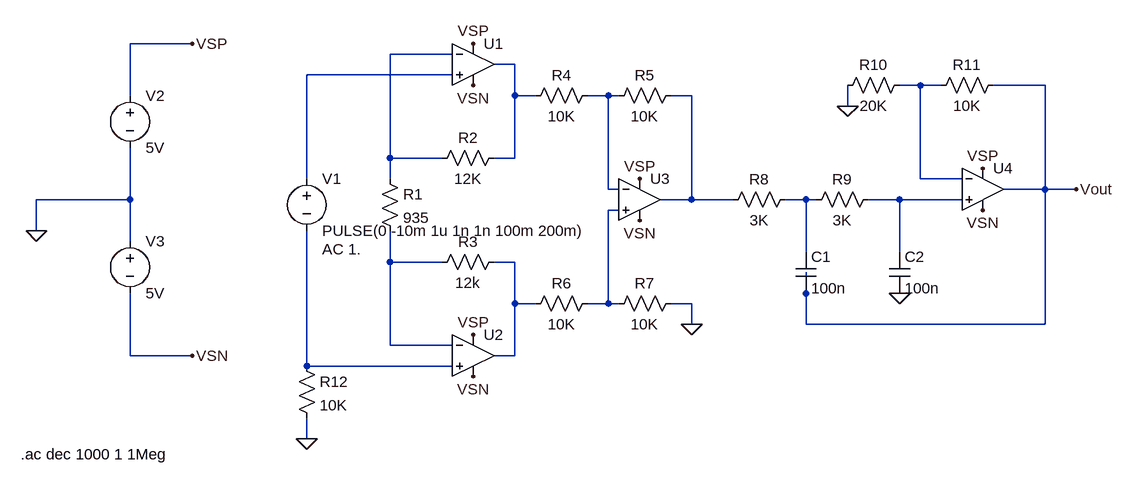
[diagram p0: schematic Draft1.asc]
Draft1.asc, the LTspice schematic file:
Version 4
SHEET 1 1476 760
WIRE 48 112 -48 112
WIRE 448 128 352 128
WIRE 544 144 512 144
WIRE 448 160 224 160
WIRE 1168 176 1136 176
WIRE 1200 176 1168 176
WIRE 1360 176 1280 176
WIRE -48 192 -48 112
WIRE 544 192 544 144
WIRE 576 192 544 192
WIRE 688 192 656 192
WIRE 704 192 688 192
WIRE 816 192 784 192
WIRE 1056 208 1056 176
WIRE 352 288 352 128
WIRE 432 288 352 288
WIRE 544 288 544 192
WIRE 544 288 512 288
WIRE 224 320 224 160
WIRE 352 320 352 288
WIRE 1168 320 1168 176
WIRE 1232 320 1168 320
WIRE 688 336 688 192
WIRE 704 336 688 336
WIRE 1360 336 1360 176
WIRE 1360 336 1296 336
WIRE 1408 336 1360 336
WIRE -48 352 -48 272
WIRE -48 352 -192 352
WIRE 816 352 816 192
WIRE 816 352 768 352
WIRE 880 352 816 352
WIRE 992 352 960 352
WIRE 1008 352 992 352
WIRE 1136 352 1088 352
WIRE 1232 352 1136 352
WIRE 704 368 688 368
WIRE -192 400 -192 352
WIRE -48 416 -48 352
WIRE 992 432 992 352
WIRE 1136 432 1136 352
WIRE 352 448 352 400
WIRE 432 448 352 448
WIRE 544 448 512 448
WIRE 992 496 992 464
WIRE 544 512 544 448
WIRE 576 512 544 512
WIRE 688 512 688 368
WIRE 688 512 656 512
WIRE 704 512 688 512
WIRE 816 512 784 512
WIRE 816 544 816 512
WIRE 992 544 992 496
WIRE 1360 544 1360 336
WIRE 1360 544 992 544
WIRE 352 576 352 448
WIRE 448 576 352 576
WIRE -48 592 -48 496
WIRE 48 592 -48 592
WIRE 544 592 544 512
WIRE 544 592 512 592
WIRE 224 608 224 400
WIRE 448 608 224 608
WIRE 224 720 224 688
FLAG -192 400 0
FLAG 48 112 VSP
FLAG 48 592 VSN
FLAG 480 112 VSP
FLAG 480 560 VSP
FLAG 736 320 VSP
FLAG 1264 304 VSP
FLAG 480 176 VSN
FLAG 480 624 VSN
FLAG 736 384 VSN
FLAG 1264 368 VSN
FLAG 224 720 0
FLAG 816 544 0
FLAG 1056 208 0
FLAG 1408 336 Vout
FLAG 1136 496 0
SYMBOL OpAmps/UniversalOpAmp2 480 144 R0
SYMATTR InstName U1
SYMBOL OpAmps/UniversalOpAmp2 480 592 R0
SYMATTR InstName U2
SYMBOL OpAmps/UniversalOpAmp2 736 352 R0
SYMATTR InstName U3
SYMBOL OpAmps/UniversalOpAmp2 1264 336 R0
SYMATTR InstName U4
SYMBOL voltage -48 176 R0
SYMATTR InstName V2
SYMATTR Value 5V
SYMBOL voltage -48 400 R0
SYMATTR InstName V3
SYMATTR Value 5V
SYMBOL res 336 304 R0
SYMATTR InstName R1
SYMATTR Value 935
SYMBOL res 528 272 R90
WINDOW 0 0 56 VBottom 2
WINDOW 3 32 56 VTop 2
SYMATTR InstName R2
SYMATTR Value 12K
SYMBOL res 528 432 R90
WINDOW 0 0 56 VBottom 2
WINDOW 3 32 56 VTop 2
SYMATTR InstName R3
SYMATTR Value 12k
SYMBOL res 672 176 R90
WINDOW 0 0 56 VBottom 2
WINDOW 3 32 56 VTop 2
SYMATTR InstName R4
SYMATTR Value 10K
SYMBOL res 800 176 R90
WINDOW 0 0 56 VBottom 2
WINDOW 3 32 56 VTop 2
SYMATTR InstName R5
SYMATTR Value 10K
SYMBOL res 672 496 R90
WINDOW 0 0 56 VBottom 2
WINDOW 3 32 56 VTop 2
SYMATTR InstName R6
SYMATTR Value 10K
SYMBOL res 800 496 R90
WINDOW 0 0 56 VBottom 2
WINDOW 3 32 56 VTop 2
SYMATTR InstName R7
SYMATTR Value 10K
SYMBOL res 976 336 R90
WINDOW 0 0 56 VBottom 2
WINDOW 3 32 56 VTop 2
SYMATTR InstName R8
SYMATTR Value 3K
SYMBOL res 1104 336 R90
WINDOW 0 0 56 VBottom 2
WINDOW 3 32 56 VTop 2
SYMATTR InstName R9
SYMATTR Value 3K
SYMBOL res 1152 160 R90
WINDOW 0 0 56 VBottom 2
WINDOW 3 32 56 VTop 2
SYMATTR InstName R10
SYMATTR Value 20K
SYMBOL res 1296 160 R90
WINDOW 0 0 56 VBottom 2
WINDOW 3 32 56 VTop 2
SYMATTR InstName R11
SYMATTR Value 10K
SYMBOL res 208 592 R0
SYMATTR InstName R12
SYMATTR Value 10K
SYMBOL cap 976 432 R0
SYMATTR InstName C1
SYMATTR Value 100n
SYMBOL cap 1120 432 R0
SYMATTR InstName C2
SYMATTR Value 100n
SYMBOL voltage 224 304 R0
WINDOW 123 24 124 Left 2
WINDOW 39 0 0 Left 0
SYMATTR Value2 AC 1.
SYMATTR InstName V1
SYMATTR Value PULSE(0 -10m 1u 1n 1n 100m 200m)
TEXT -216 744 Left 2 !.ac dec 1000 1 1Meg

The netlist it stands for:
* Draft1.asc
XU1 N003 N001 VSP VSN N002 level2 Avol=1Meg GBW=10Meg Slew=10Meg Ilimit=25m Rail=0 Vos=0 En=0 Enk=0 In=0 Ink=0 Rin=500Meg  ; pins In+ In- V+ V- OUT
XU2 N012 N010 VSP VSN N011 level2 Avol=1Meg GBW=10Meg Slew=10Meg Ilimit=25m Rail=0 Vos=0 En=0 Enk=0 In=0 Ink=0 Rin=500Meg  ; pins In+ In- V+ V- OUT
XU3 N009 N005 VSP VSN N006 level2 Avol=1Meg GBW=10Meg Slew=10Meg Ilimit=25m Rail=0 Vos=0 En=0 Enk=0 In=0 Ink=0 Rin=500Meg  ; pins In+ In- V+ V- OUT
XU4 N008 N004 VSP VSN Vout level2 Avol=1Meg GBW=10Meg Slew=10Meg Ilimit=25m Rail=0 Vos=0 En=0 Enk=0 In=0 Ink=0 Rin=500Meg  ; pins In+ In- V+ V- OUT
V2 VSP 0 5V
V3 0 VSN 5V
R1 N001 N010 935
R2 N002 N001 12K
R3 N011 N010 12k
R4 N005 N002 10K
R5 N006 N005 10K
R6 N009 N011 10K
R7 0 N009 10K
R8 N007 N006 3K
R9 N008 N007 3K
R10 N004 0 20K
R11 Vout N004 10K
R12 N012 0 10K
C1 N007 Vout 100n
C2 N008 0 100n
V1 N003 N012 PULSE(0 -10m 1u 1n 1n 100m 200m) AC 1.
.ac dec 1000 1 1Meg
.lib UniversalOpAmp2.lib
.backanno
.end